# EAGLE schematic Buttons (EAGLE 6.3)
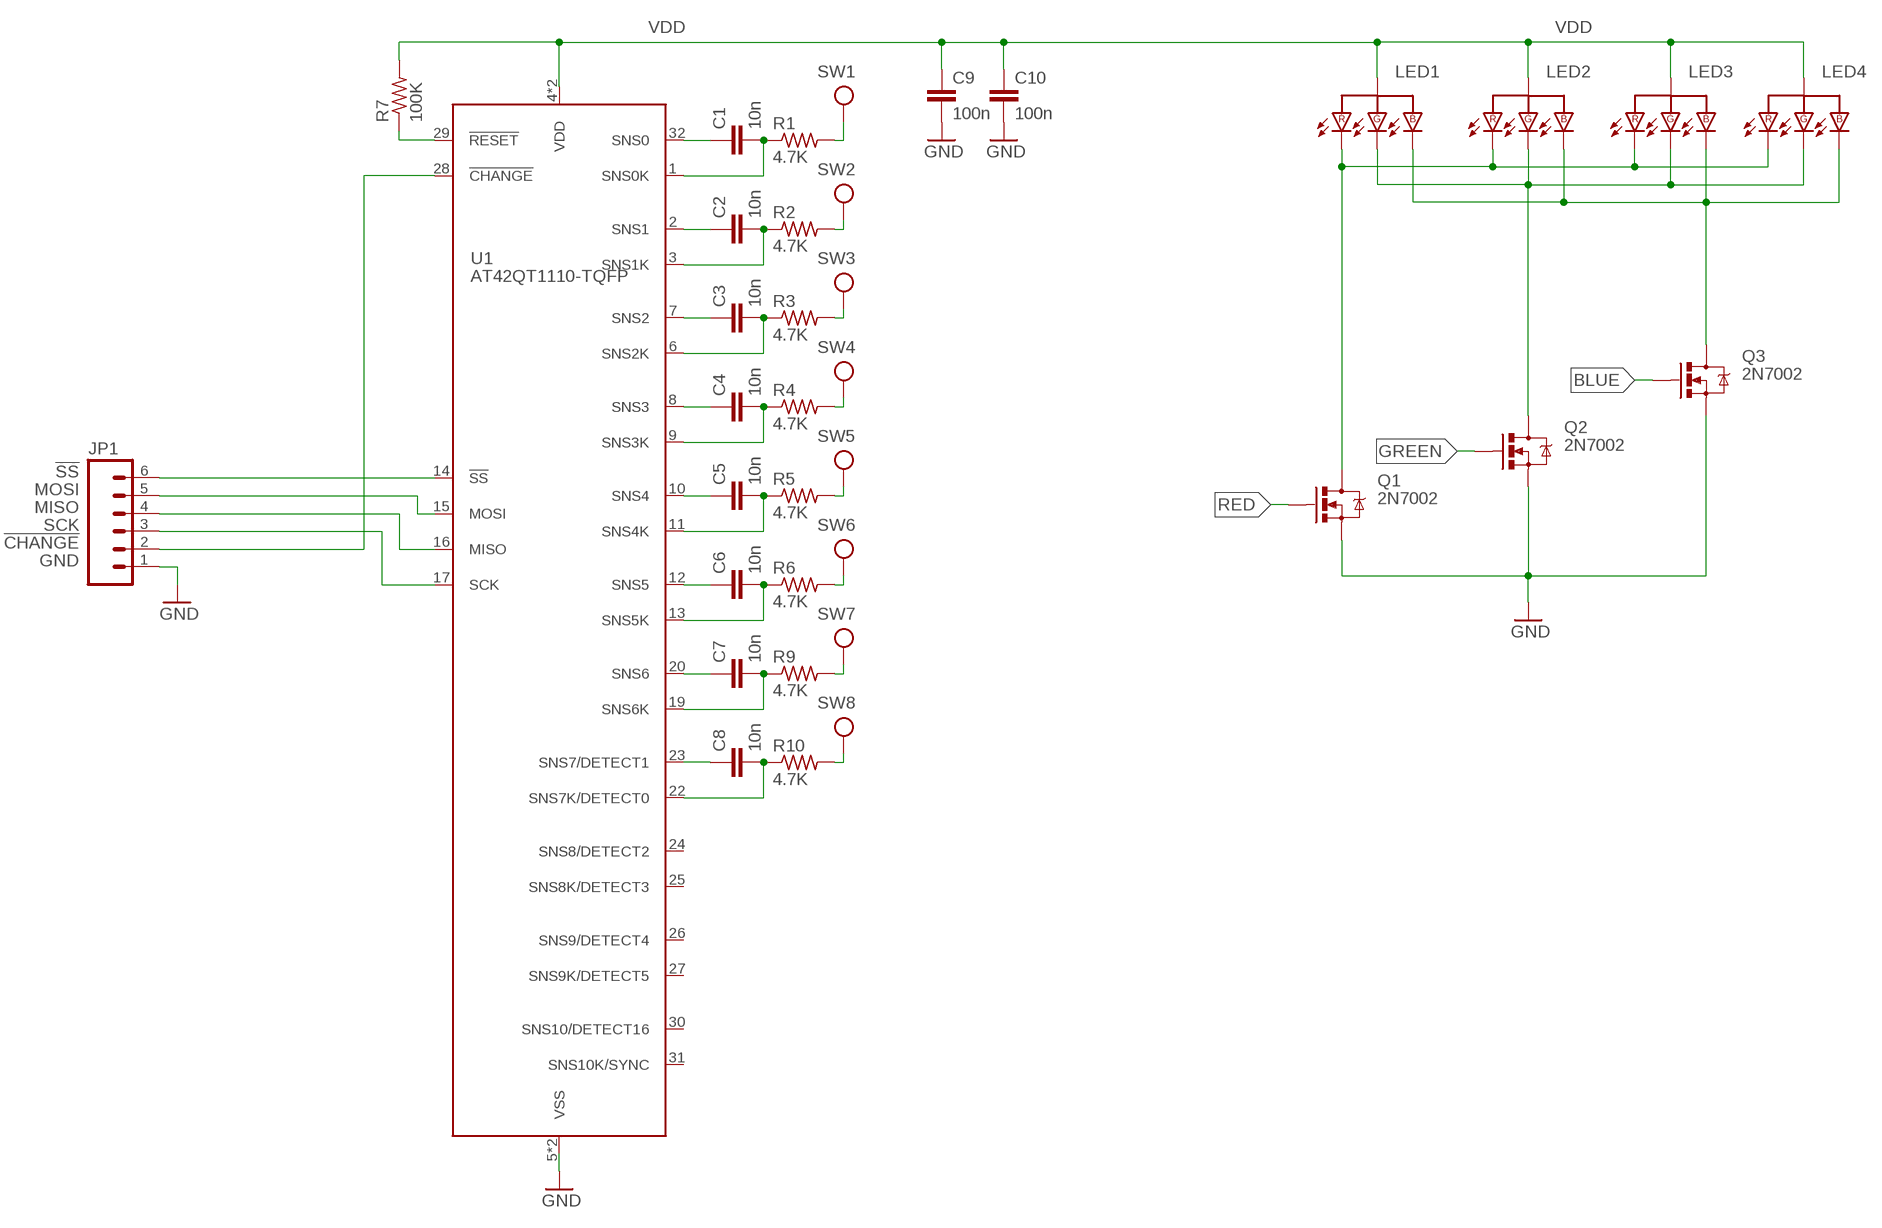
[diagram p0: schematic, sheet 1]

## Parts
C1  10n  C-EUC0603  [C0603]
C2  10n  C-EUC0603  [C0603]
C3  10n  C-EUC0603  [C0603]
C4  10n  C-EUC0603  [C0603]
C5  10n  C-EUC0603  [C0603]
C6  10n  C-EUC0603  [C0603]
C7  10n  C-EUC0603  [C0603]
C8  10n  C-EUC0603  [C0603]
C9  100n  C-EUC0603  [C0603]
C10  100n  C-EUC0603  [C0603]
JP1  M06SMD-STRAIGHT  [1X06_SMD_STRAIGHT]
LED1  LED_RGB  [PLCC-4]
LED2  LED_RGB  [PLCC-4]
LED3  LED_RGB  [PLCC-4]
LED4  LED_RGB  [PLCC-4]
Q1  2N7002  MOSFET-NCHANNELSMD  [SOT23-3]
Q2  2N7002  MOSFET-NCHANNELSMD  [SOT23-3]
Q3  2N7002  MOSFET-NCHANNELSMD  [SOT23-3]
R1  4.7K  R-US_R0603  [R0603]
R2  4.7K  R-US_R0603  [R0603]
R3  4.7K  R-US_R0603  [R0603]
R4  4.7K  R-US_R0603  [R0603]
R5  4.7K  R-US_R0603  [R0603]
R6  4.7K  R-US_R0603  [R0603]
R7  100K  R-US_R0603  [R0603]
R9  4.7K  R-US_R0603  [R0603]
R10  4.7K  R-US_R0603  [R0603]
SW1  TOUCH_PAD-CIRCLE-15MM  [TOUCH-CIRCLE-15MM]
SW2  TOUCH_PAD-CIRCLE-15MM  [TOUCH-CIRCLE-15MM]
SW3  TOUCH_PAD-CIRCLE-15MM  [TOUCH-CIRCLE-15MM]
SW4  TOUCH_PAD-CIRCLE-15MM  [TOUCH-CIRCLE-15MM]
SW5  TOUCH_PAD-CIRCLE-15MM  [TOUCH-CIRCLE-15MM]
SW6  TOUCH_PAD-CIRCLE-15MM  [TOUCH-CIRCLE-15MM]
SW7  TOUCH_PAD-CIRCLE-15MM  [TOUCH-CIRCLE-15MM]
SW8  TOUCH_PAD-CIRCLE-15MM  [TOUCH-CIRCLE-15MM]
U1  AT42QT1110-TQFP  [S-PQFP-N32]

## Nets
BLUE: Q3.1(G)
GND: C9.2 C10.2 JP1.1 Q1.2(S) Q2.2(S) Q3.2(S) U1.5(VSS) U1.21(VSS)
GREEN: Q2.1(G)
N$1: C1.2 R1.1 U1.1(SNS0K)
N$2: C2.2 R2.1 U1.3(SNS1K)
N$3: C3.2 R3.1 U1.6(SNS2K)
N$4: C4.2 R4.1 U1.9(SNS3K)
N$5: C5.2 R5.1 U1.11(SNS4K)
N$6: C6.2 R6.1 U1.13(SNS5K)
N$7: C1.1 U1.32(SNS0)
N$8: R1.2 SW1.P$1
N$9: C2.1 U1.2(SNS1)
N$10: R2.2 SW2.P$1
N$11: C3.1 U1.7(SNS2)
N$12: R3.2 SW3.P$1
N$13: C4.1 U1.8(SNS3)
N$14: R4.2 SW4.P$1
N$15: C5.1 U1.10(SNS4)
N$16: R5.2 SW5.P$1
N$17: C6.1 U1.12(SNS5)
N$18: R6.2 SW6.P$1
N$19: R7.1 U1.29(!RESET)
N$20: JP1.2 U1.28(!CHANGE)
N$21: LED1.1(KR) LED2.1(KR) LED3.1(KR) LED4.1(KR) Q1.3(D)
N$22: C8.2 R10.1 U1.22(SNS7K/DETECT0)
N$23: C7.2 R9.1 U1.19(SNS6K)
N$24: LED1.4(KG) LED2.4(KG) LED3.4(KG) LED4.4(KG) Q2.3(D)
N$25: JP1.6 U1.14(!SS)
N$26: JP1.5 U1.15(MOSI)
N$27: JP1.4 U1.16(MISO)
N$28: JP1.3 U1.17(SCK)
N$29: R10.2 SW8.P$1
N$30: R9.2 SW7.P$1
N$31: C8.1 U1.23(SNS7/DETECT1)
N$32: C7.1 U1.20(SNS6)
N$33: LED1.3(KB) LED2.3(KB) LED3.3(KB) LED4.3(KB) Q3.3(D)
RED: Q1.1(G)
VDD: C9.1 C10.1 LED1.2(A) LED2.2(A) LED3.2(A) LED4.2(A) R7.2 U1.4(VDD) U1.18(VDD)
Unconnected: U1.24(SNS8/DETECT2) U1.25(SNS8K/DETECT3) U1.26(SNS9/DETECT4) U1.27(SNS9K/DETECT5) U1.30(SNS10/DETECT16) U1.31(SNS10K/SYNC)

## Notes on the sheet
- !SS
- MOSI
- MISO
- SCK
- !CHANGE
- GND

## Library data of the parts
C1-C10 = rcl:C-EU: CAPACITOR, European symbol
JP1 = SparkFun-Connectors:M06: Header 6 Standard 6-pin 0.1" header. Use with straight break away headers (SKU : PRT-00116), right angle break away headers (PRT-00553), swiss pins (PRT-00743), machine pins (PRT-00117), and female headers (PRT-00115). Molex polarized connector foot print use with SKU : PRT-08094 with associated crimp pins and housings. NOTES ON THE VARIANTS LOCK and LOCK_LONGPADS... This footprint was designed to help hold the alignment of a through-hole component (i.e. 6-pin header) while soldering it into place. You may notice that each hole has been shifted either up or down by 0.005 of an inch from it's more standard position (which is a perfectly straight line). This slight alteration caused the pins (the squares in the middle) to touch the edges of the holes. Because they are alternating, it causes a "brace" to hold the component in place. 0.005 has proven to be the perfect amount of "off-center" position when using our standard breakaway headers. Although looks a little odd when you look at the bare footprint, once you have a header in there, the alteration is very hard to notice. Also, if you push a header all the way into place, it is covered up entirely on the bottom side. This idea of altering the position of holes to aid alignment will be further integrated into the Sparkfun Library for other footprints. It can help hold any component with 3 or more connection pins.
LED1-LED4 = 00-EvaLibrary:LED_RGB
Q1-Q3 = SparkFun-DiscreteSemi:MOSFET-NCHANNEL: Generic NMOS footprint
R1-R7 R9 R10 = rcl:R-US_: RESISTOR, American symbol
SW1-SW8 = 00-EvaLibrary:TOUCH_PAD
U1 = 00-EvaLibrary:AT42QT1110